# EAGLE design erprog_1504-1 (EAGLE 6.6.0)
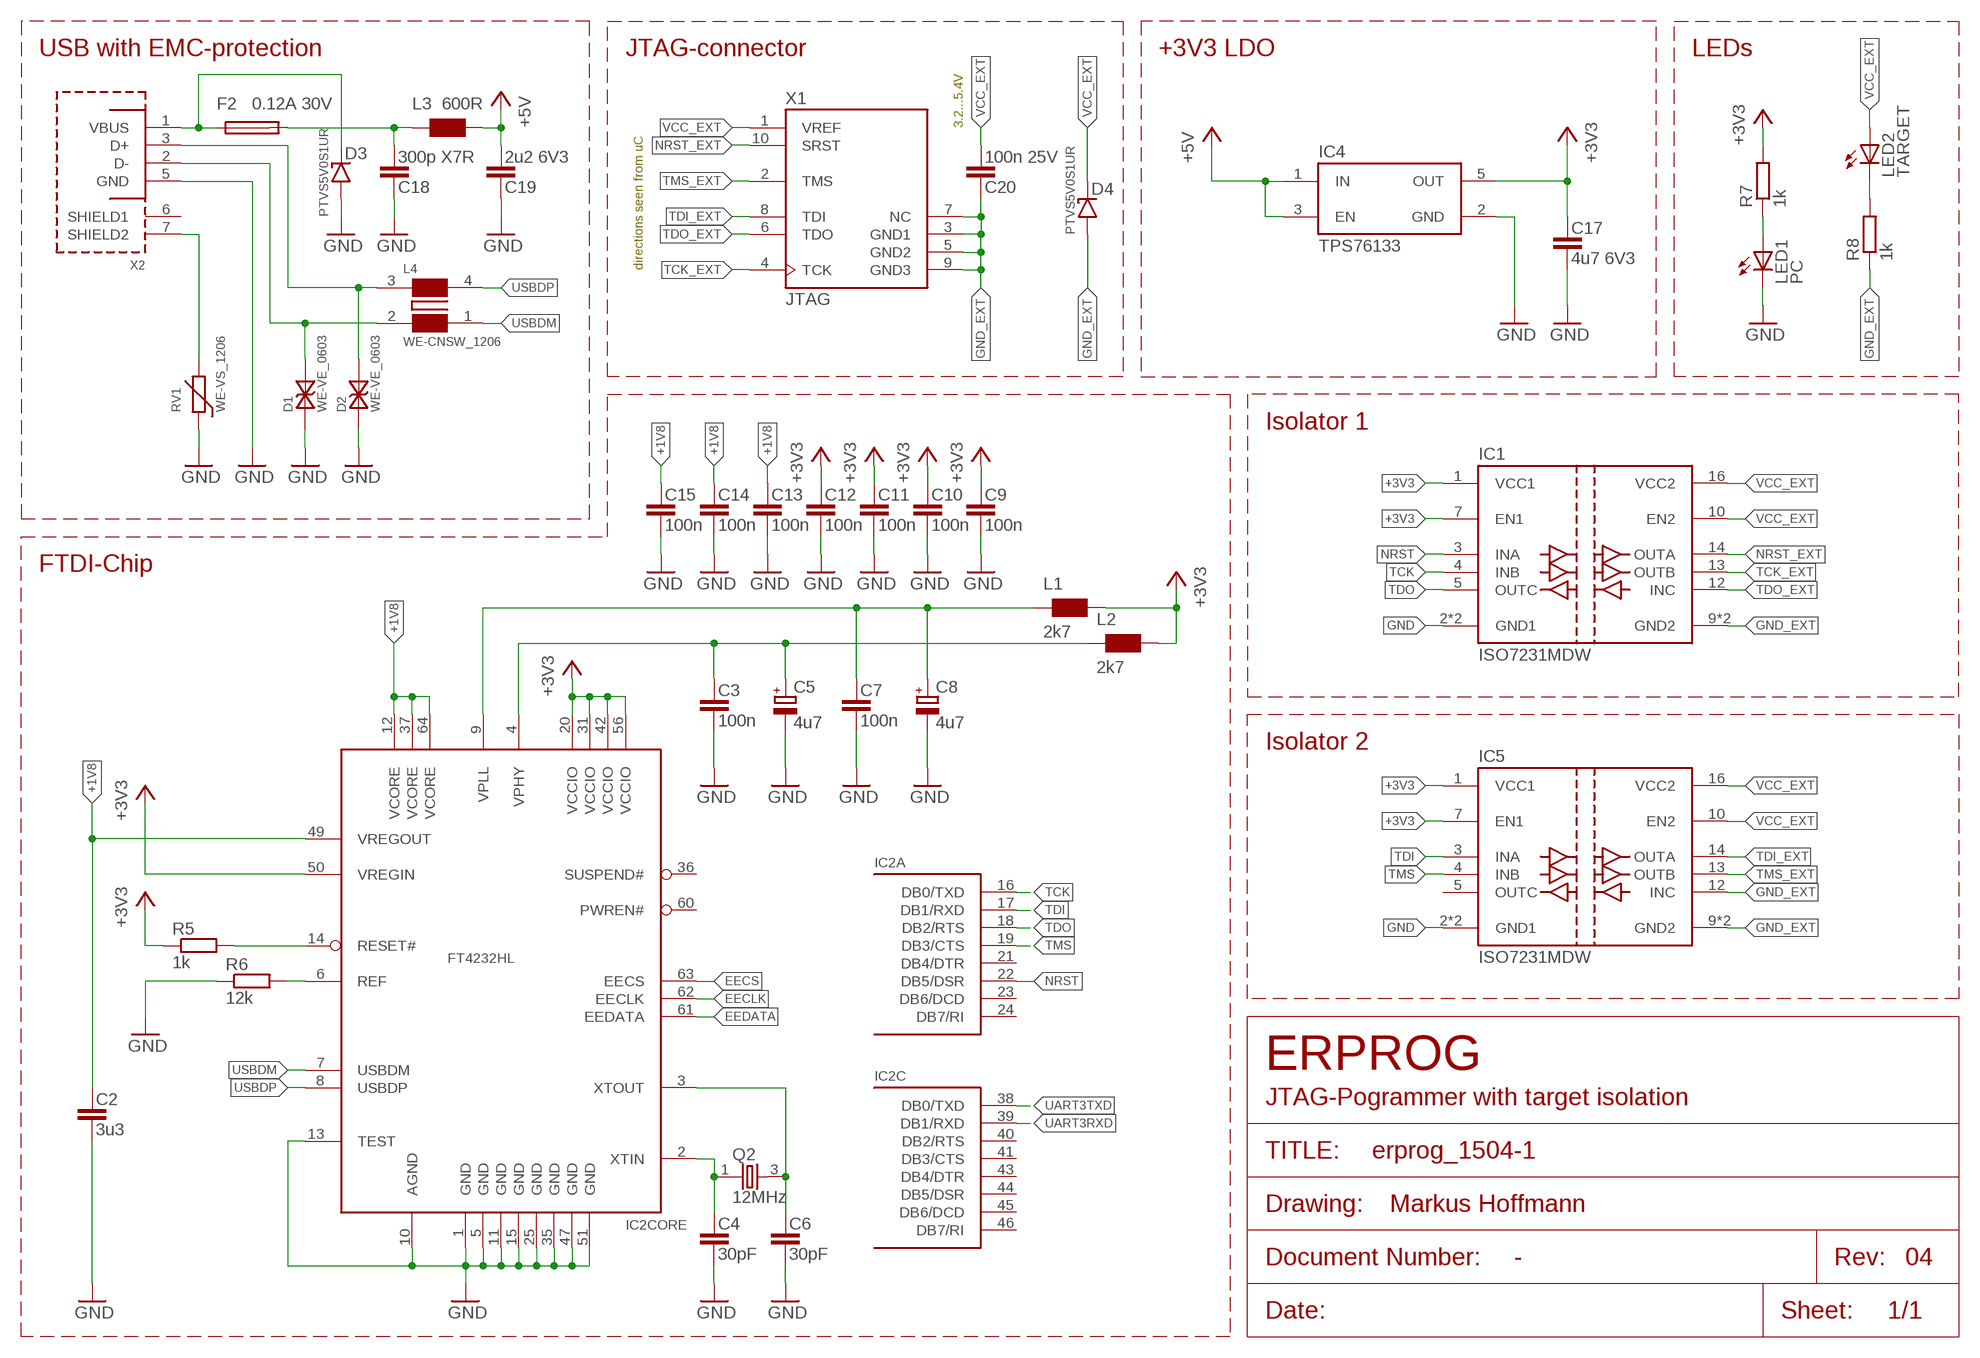
[diagram p0: schematic, sheet 1]
FRAME1 (DINA4_L): AUTHOR: Markus Hoffmann; DOC_NUMBER: -; REVISION: 04; SUBTITLE: JTAG-Pogrammer with target isolation; TITLE: ERPROG

## Parts
C2  3u3  C-EUC0603  [C0603]
C3  100n  C-EUC0603  [C0603]
C4  30pF  C-EUC0603  [C0603]
C5  4u7  CPOL-EUA/3216-18R  [A/3216-18R]
C6  30pF  C-EUC0603  [C0603]
C7  100n  C-EUC0603  [C0603]
C8  4u7  CPOL-EUA/3216-18R  [A/3216-18R]
C9  100n  C-EUC0603  [C0603]
C10  100n  C-EUC0603  [C0603]
C11  100n  C-EUC0603  [C0603]
C12  100n  C-EUC0603  [C0603]
C13  100n  C-EUC0603  [C0603]
C14  100n  C-EUC0603  [C0603]
C15  100n  C-EUC0603  [C0603]
C17  4u7 6V3  C-EUC0805  [C0805]
C18  300p X7R  C-EUC0603  [C0603]
C19  2u2 6V3  C-EUC0603  [C0603]
C20  100n 25V  C-EUC0603  [C0603]
D1  WE-VE_0603  [WESURGE_0603]
D2  WE-VE_0603  [WESURGE_0603]
D3  PTVS5V0S1UR  [SOD123]
D4  PTVS5V0S1UR  [SOD123]
F2  0.12A 30V  MF-NSMF012-2  [MF-NSMF-1]
IC1  ISO7231MDW  [SO16_SOT162-1]
IC2  FT4232HL  [LQFP64]
IC4  TPS76133  TPS76133SOT23  [SOT-23-5]
IC5  ISO7231MDW  [SO16_SOT162-1]
L1  2k7  WE-CBF_0805  [0805]
L2  2k7  WE-CBF_0805  [0805]
L3  600R  WE-CBF_0805  [0805]
L4  WE-CNSW_1206  [WE-CNSW_1206]
LED1  PC  LEDSML0805  [SML0805]
LED2  TARGET  LEDSML0805  [SML0805]
Q2  12MHz  MQ  [MQ]
R5  1k  R-EU_R0603  [R0603]
R6  12k  R-EU_R0603  [R0603]
R7  1k  R-EU_R0603  [R0603]
R8  1k  R-EU_R0603  [R0603]
RV1  WE-VS_1206  [WESURGE_1206]
X1  JTAG  CORESIGHT-JTAG-10THD10R  [ML10R]
X2  USB-SHIELD-MINI-B-BUCHSE-R-ASSMANN  [USB-MINI-B-BUCHSE-R]

## Nets
+1V8: C2.1 C13.1 C14.1 C15.1 IC2.12(CORE:VCORE) IC2.37(CORE:VCORE) IC2.49(CORE:VREGOUT) IC2.64(CORE:VCORE)
+3V3: C9.1 C10.1 C11.1 C12.1 C17.1 IC1.1(VCC1) IC1.7(EN1) IC2.20(CORE:VCCIO) IC2.31(CORE:VCCIO) IC2.42(CORE:VCCIO) IC2.50(CORE:VREGIN) IC2.56(CORE:VCCIO) IC4.5(OUT) IC5.1(VCC1) IC5.7(EN1) L1.2 L2.2 R5.1 R7.2
+5V: C19.2 IC4.1(IN) IC4.3(EN) L3.2
EECLK: IC2.62(CORE:EECLK)
EECS: IC2.63(CORE:EECS)
EEDATA: IC2.61(CORE:EEDATA)
GND: C2.2 C3.2 C4.2 C5.- C6.2 C7.2 C8.- C9.2 C10.2 C11.2 C12.2 C13.2 C14.2 C15.2 C17.2 C18.1 C19.1 D1.2 D2.2 D3.A(ANODE) IC1.2(GND1) IC1.8(GND1) IC2.1(CORE:GND) IC2.5(CORE:GND) IC2.10(CORE:AGND) IC2.11(CORE:GND) IC2.13(CORE:TEST) IC2.15(CORE:GND) IC2.25(CORE:GND) IC2.35(CORE:GND) IC2.47(CORE:GND) IC2.51(CORE:GND) IC4.2(GND) IC5.2(GND1) IC5.8(GND1) LED1.C R6.1 RV1.1 X2.5(GND)
GND_EXT: C20.1 D4.A(ANODE) IC1.9(GND2) IC1.15(GND2) IC5.9(GND2) IC5.12(INC) IC5.15(GND2) R8.1 X1.3(GND1) X1.5(GND2) X1.7(NC) X1.9(GND3)
N$1: D3.C(KATHODE) F2.1 X2.1(VBUS)
N$2: LED1.A R7.1
N$3: D1.1 L4.2 X2.2(D-)
N$4: RV1.2 X2.7(SHIELD2)
N$5: LED2.C R8.2
N$6: C18.2 F2.2 L3.1
N$7: D2.1 L4.3 X2.3(D+)
N$39: IC2.14(CORE:RESET#) R5.2
N$40: IC2.6(CORE:REF) R6.2
N$44: C3.1 C5.+ IC2.4(CORE:VPHY) L2.1
N$45: C7.1 C8.+ IC2.9(CORE:VPLL) L1.1
N$46: C6.1 IC2.3(CORE:XTOUT) Q2.3
N$47: C4.1 IC2.2(CORE:XTIN) Q2.1
NRST: IC1.3(INA) IC2.22(A:DB5/DSR)
NRST_EXT: IC1.14(OUTA) X1.10(SRST)
TCK: IC1.4(INB) IC2.16(A:DB0/TXD)
TCK_EXT: IC1.13(OUTB) X1.4(TCK)
TDI: IC2.17(A:DB1/RXD) IC5.3(INA)
TDI_EXT: IC5.14(OUTA) X1.8(TDI)
TDO: IC1.5(OUTC) IC2.18(A:DB2/RTS)
TDO_EXT: IC1.12(INC) X1.6(TDO)
TMS: IC2.19(A:DB3/CTS) IC5.4(INB)
TMS_EXT: IC5.13(OUTB) X1.2(TMS)
UART3RXD: IC2.39(C:DB1/RXD)
UART3TXD: IC2.38(C:DB0/TXD)
USBDM: IC2.7(CORE:USBDM) L4.1
USBDP: IC2.8(CORE:USBDP) L4.4
VCC_EXT: C20.2 D4.C(KATHODE) IC1.10(EN2) IC1.16(VCC2) IC5.10(EN2) IC5.16(VCC2) LED2.A X1.1(VREF)
Unconnected: IC2.21(A:DB4/DTR) IC2.23(A:DB6/DCD) IC2.24(A:DB7/RI) IC2.26(B:DB0/TXD) IC2.27(B:DB1/RXD) IC2.28(B:DB2/RTS) IC2.29(B:DB3/CTS) IC2.30(B:DB4/DTR) IC2.32(B:DB5/DSR) IC2.33(B:DB6/DCD) IC2.34(B:DB7/RI) IC2.36(CORE:SUSPEND#) IC2.40(C:DB2/RTS) IC2.41(C:DB3/CTS) IC2.43(C:DB4/DTR) IC2.44(C:DB5/DSR) IC2.45(C:DB6/DCD) IC2.46(C:DB7/RI) IC2.48(D:DB0/TXD) IC2.52(D:DB1/RXD) IC2.53(D:DB2/RTS) IC2.54(D:DB3/CTS) IC2.55(D:DB4/DTR) IC2.57(D:DB5/DSR) IC2.58(D:DB6/DCD) IC2.59(D:DB7/RI) IC2.60(CORE:PWREN#) IC5.5(OUTC) X2.6(SHIELD1)

## Notes on the sheet
- USB with EMC-protection | JTAG-connector | +3V3 LDO | LEDs
- 3.2...5.4V
- directions seen from uC
- Isolator 1
- FTDI-Chip
- Isolator 2

## Library data of the parts
C2-C4 C6 C7 C9-C15 C17-C20 = rcl:C-EU: CAPACITOR, European symbol
C5 C8 = rcl:CPOL-EU: POLARIZED CAPACITOR, European symbol
D1 D2 = wuerth_elektronik_v68:WE-VE: WESURGE ESD Suppressor WE-VE - Fast response time - No leakage current - Low clamping voltage - Almost no energy consumption in stand-by mode - Excellent absorption for ESD-impulses - Designed to meet the EN 61000-4-2 standard - Nickel barrier - Operating temperature: -40°C to +85°C -- Protection of data lines -- Protection of bus system -- Protection of semiconductors -- ESD protection in accordance with EN 61000-4-2; 8 kV contact discharge / 15 kV air discharge; WE: 82356240030; WUERTH_ELETRONIK: 82356240030
D3 D4 = diode:PTVS*S1UR: 400 W unidirectional Transient Voltage Suppressor (TVS) in a SOD123W small and flat lead low-profile Surface-Mounted Device (SMD) plastic package, designed for transient overvoltage protection.; FARNELL: 1829262; MOUSER: 771-PTVS5V0S1UR115; NXP: PTVS5V0S1UR; PRICE100: 0.243; V_BR: 6.70V
F2 = fuse:MF-NSMF; BOURNS: MF-NSMF012-2; FARNELL: 2309137; I_HOLD: 0.120A; PRICE5: 0.477; U_MAX: 30V
IC1 IC5 = ti:ISO7231*?
IC2 = ftdichip-5:FT4232H: Quad USB UART 5th generation USB to 4-port serial controller; FARNELL: 1697463; PRICE: 11,29€
IC4 = vreg:TPS76*: The TPS761xx is a 100 mA, low dropout (LDO) voltage regulator designed specifically for battery-powered applications. A proprietary BiCMOS fabrication process allows the TPS761xx to provide outstanding performance in all specifications critical to battery-powered operation. The TPS761xx is available in a space-saving SOT-23 (DBV) package and operates over a junction temperature range of –40 ° C to 125 ° C.; FARNELL: 8461295; PRICE: 1,17€; TI: TPS76133
L1 L2 = wuerth_elektronik_v68:WE-CBF: SMD EMI Suppression Ferrite Beads WE-CBF - Excellent anti-EMI properties - Low DC-restistance - Impedances till 3000 ohms - Rated current up to 6 A -- Reliable Ni-Sn electrodes -- Perfect as data lined filter and for uncoupling of distribution voltage; FARNELL: 1800366; WE: 742792095
L3 = wuerth_elektronik_v68:WE-CBF: SMD EMI Suppression Ferrite Beads WE-CBF - Excellent anti-EMI properties - Low DC-restistance - Impedances till 3000 ohms - Rated current up to 6 A -- Reliable Ni-Sn electrodes -- Perfect as data lined filter and for uncoupling of distribution voltage; WE: 742792040
L4 = wuerth_elektronik_v68:WE-CNSW: SMD Common Mode Noise Suppressor WE-CNSW - High common mode suppression at high frequency - Small influence for high speed signals through winding symmetry -- USB 2.0 -- Firewire / IEEE 1394 -- Power supply systems -- High Speed Data Lines -- Common mode data line filter; FARNELL: 1636474; PRICE1: 1.01; WE: 744232090; WUERTH_ELETRONIK: 744232090
LED1 LED2 = led:LED: LED OSRAM: - CHIPLED LG R971, LG N971, LY N971, LG Q971, LY Q971, LO R971, LY R971 LH N974, LH R974 LS Q976, LO Q976, LY Q976 LO Q996 - Hyper CHIPLED LW Q18S LB Q993, LB Q99A, LB R99A - SideLED LS A670, LO A670, LY A670, LG A670, LP A670 LB A673, LV A673, LT A673, LW A673 LH A674 LY A675 LS A676, LA A676, LO A676, LY A676, LW A676 LS A679, LY A679, LG A679 - Hyper Micro SIDELED® LS Y876, LA Y876, LO Y876, LY Y876 LT Y87S - SmartLED LW L88C, LW L88S LB L89C, LB L89S, LG L890 LS L89K, LO L89K, LY L89K LS L896, LA L896, LO L896, LY L896 - TOPLED LS T670, LO T670, LY T670, LG T670, LP T670 LSG T670, LSP T670, LSY T670, LOP T670, LYG T670 LG T671, LOG T671, LSG T671 LB T673, LV T673, LT T673, LW T673 LH T674 LS T676, LA T676, LO T676, LY T676, LB T676, LH T676, LSB T676, LW T676 LB T67C, LV T67C, LT T67C, LS T67K, LO T67K, LY T67K, LW E67C LS E67B, LA E67B, LO E67B, LY E67B, LB E67C, LV E67C, LT E67C LW T67C LS T679, LY T679, LG T679 LS T770, LO T770, LY T770, LG T770, LP T770 LB T773, LV T773, LT T773, LW T773 LH T774 LS E675, LA E675, LY E675, LS T675 LS T776, LA T776, LO T776, LY T776, LB T776 LHGB T686 LT T68C, LB T68C - Hyper Mini TOPLED® LB M676 - Mini TOPLED Santana® LG M470 LS M47K, LO M47K, LY M47K Source: http://www.osram.convergy.de LUXEON: - LUMILED® LXK2-PW12-R00, LXK2-PW12-S00, LXK2-PW14-U00, LXK2-PW14-V00 LXK2-PM12-R00, LXK2-PM12-S00, LXK2-PM14-U00 LXK2-PE12-Q00, LXK2-PE12-R00, LXK2-PE12-S00, LXK2-PE14-T00, LXK2-PE14-U00 LXK2-PB12-K00, LXK2-PB12-L00, LXK2-PB12-M00, LXK2-PB14-N00, LXK2-PB14-P00, LXK2-PB14-Q00 LXK2-PR12-L00, LXK2-PR12-M00, LXK2-PR14-Q00, LXK2-PR14-R00 LXK2-PD12-Q00, LXK2-PD12-R00, LXK2-PD12-S00 LXK2-PH12-R00, LXK2-PH12-S00 LXK2-PL12-P00, LXK2-PL12-Q00, LXK2-PL12-R00 Source: www.luxeon.com KINGBRIGHT: KA-3528ASYC Source: www.kingbright.com
Q2 = crystal-1:MQ
R5-R8 = rcl:R-EU_: RESISTOR, European symbol
RV1 = wuerth_elektronik_v68:WE-VS: WESURGE SMD Varistor WE-VS - Fast response time - Low leakage current - Low clamping voltage - Wide range of voltage avaible - Almost no energy consumption in stand-by mode - Excellent absorption at surge-impulses - Nickel barrier for leadfree soldering - Operating temperature: -40°C to +85°C for size 0402 to 0805; -40°C to +1255°C for size 1206 to 2220 -- Protection of DC distribution -- Protection of power supply -- Protection of semiconductors -- Protection of bus systems and communication lines -- Limiting of over-voltage -- ESD protection in accordance with EN 61000-4-2 and Surge protection in accordance with EN 61000-4-5; FARNELL: 1636449; PRICE1: 0.74; WE: 82541140; WUERTH_ELEKTRONIK: 82541140
X1 = con-programming:CORESIGHT-JTAG-10: CoreSight 10 The CoreSight 10 connector can be used in either standard JTAG (IEEE 1149.1) mode or Serial Wire Debug (SWD) mode.; PRICE1: 0.109; REICHELT: WSL 10W
X2 = con-usb-3:USB-SHIELD; ASSMANN: A-USBB-M5; PRICE: 1,10€; REICHELT: USB BWM

## Board
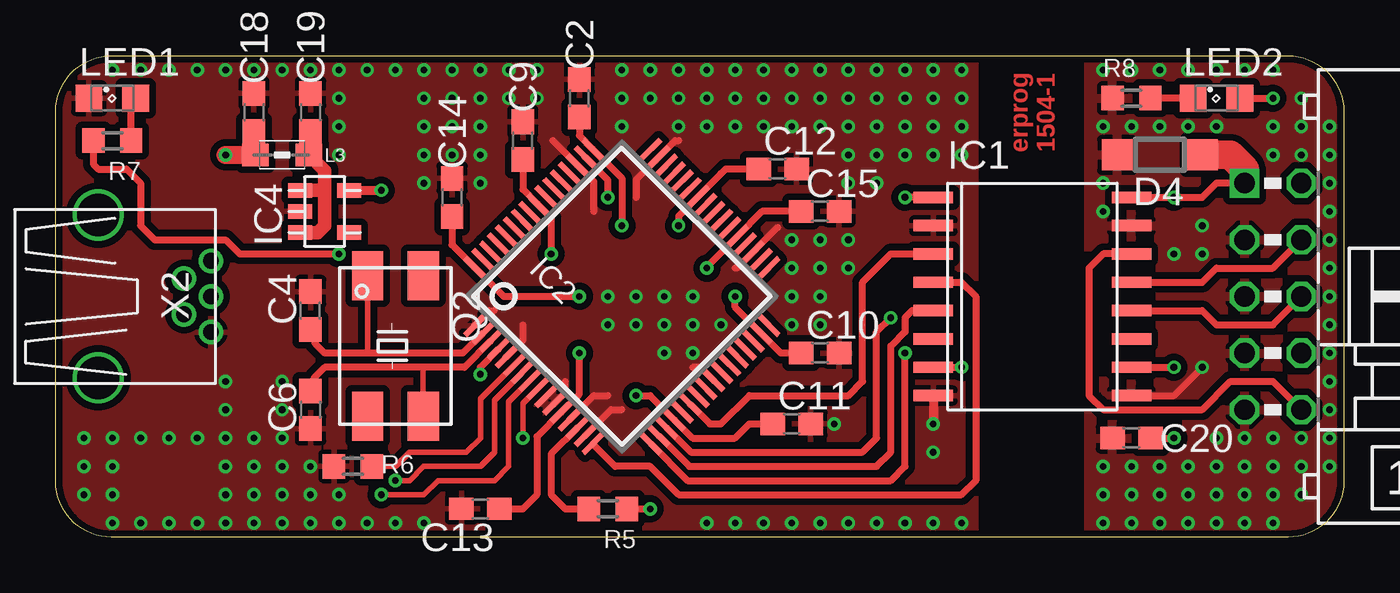
[diagram p1: board, top side]
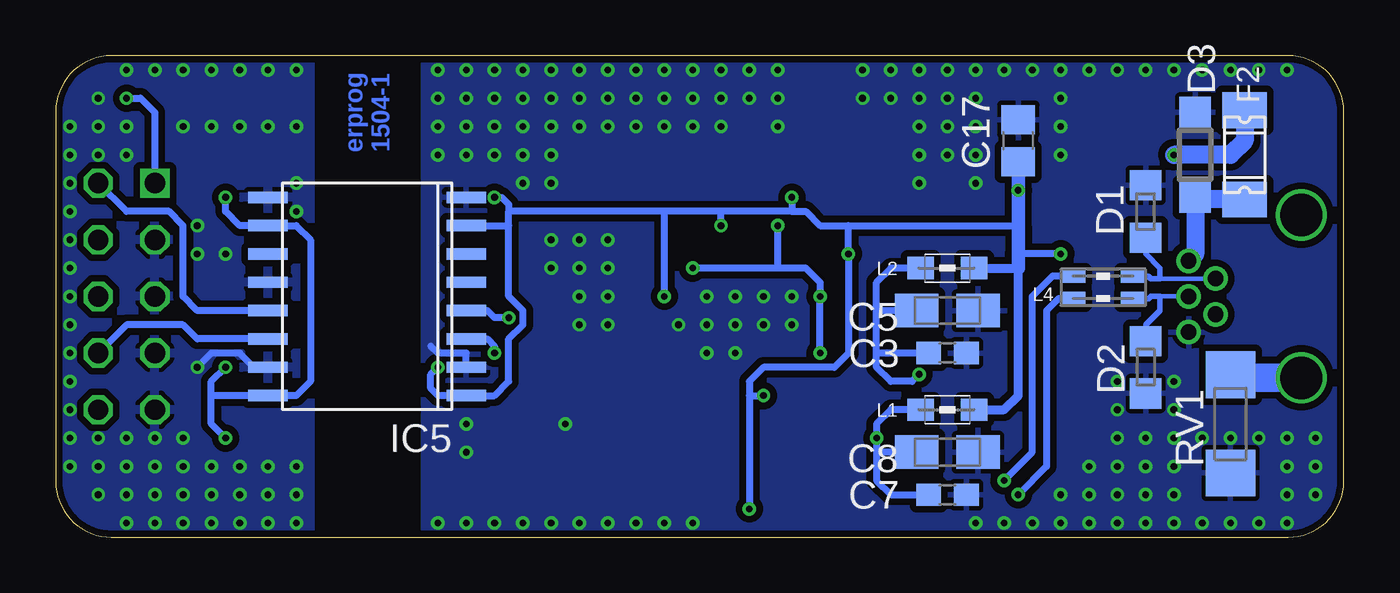
[diagram p2: board, bottom side, seen from below]

Size 57.78 x 21.59 mm. Coordinates in mm from the lower left corner, seen from the top.
Outline: 0,19.09 arc-90 2.5,21.59 55.28,21.59 arc-90 57.78,19.09 57.78,2.5 arc-90 55.28,0 2.5,0 arc-90 0,2.5 0,19.09
Copper layers (1*16): Top 0.035mm / dielectric 1.5mm / Bottom 0.035mm
Design rules "PCB-POOL_Standard": minimum track width 0.15mm, minimum drill 0.3mm, track to track 0.15mm, track to pad 0.15mm, pad to pad 0.15mm, via to via 0.15mm, smd to smd 0.15mm, copper to edge 0.3mm, drill to drill 0.2mm, minimum pad ring 0.2mm, minimum via ring 0.15mm, stop-mask expansion 0.075mm, vias tented up to drill 0mil, thermal gap 0.2mm

### Footprints (pad centres in the part's own frame; a part is rotated, then mirrored left to right if it is on the bottom)
C0603 = smd 1.1 x 1: 1 -0.85,0; 2 0.85,0
A/3216-18R = smd 1.95 x 1.5: + 1.375,0; - -1.375,0
C0805 = smd 1.3 x 1.5: 1 -0.95,0; 2 0.95,0
WESURGE_0603 = smd 1.35 x 1.4: 1 -1.175,0; 2 1.175,0
SOD123 = smd 1.4 x 1.4: A 1.9,0; C -1.9,0
MF-NSMF-1 = smd 1.6 x 2: 1 -2,0; 2 2,0
SO16_SOT162-1 = smd 1.778 x 0.508: 1 -4.445,4.445; 2 -4.445,3.175; 3 -4.445,1.905; 4 -4.445,0.635; 5 -4.445,-0.635; 6 -4.445,-1.905; 7 -4.445,-3.175; 8 -4.445,-4.445; 9 4.445,-4.445; 10 4.445,-3.175; 11 4.445,-1.905; 12 4.445,-0.635; 13 4.445,0.635; 14 4.445,1.905; 15 4.445,3.175; 16 4.445,4.445
LQFP64 = smd 0.25 x 1.2: 1 -3.75,-5.6; 2 -3.25,-5.6; 3 -2.75,-5.6; 4 -2.25,-5.6; 5 -1.75,-5.6; 6 -1.25,-5.6; 7 -0.75,-5.6; 8 -0.25,-5.6; 9 0.25,-5.6; 10 0.75,-5.6; 11 1.25,-5.6; 12 1.75,-5.6; 13 2.25,-5.6; 14 2.75,-5.6; 15 3.25,-5.6; 16 3.75,-5.6; 33 3.75,5.6; 34 3.25,5.6; 35 2.75,5.6; 36 2.25,5.6; 37 1.75,5.6; 38 1.25,5.6; 39 0.75,5.6; 40 0.25,5.6; 41 -0.25,5.6; 42 -0.75,5.6; 43 -1.25,5.6; 44 -1.75,5.6; 45 -2.25,5.6; 46 -2.75,5.6; 47 -3.25,5.6; 48 -3.75,5.6 | smd 1.2 x 0.25: 17 5.6,-3.75; 18 5.6,-3.25; 19 5.6,-2.75; 20 5.6,-2.25; 21 5.6,-1.75; 22 5.6,-1.25; 23 5.6,-0.75; 24 5.6,-0.25; 25 5.6,0.25; 26 5.6,0.75; 27 5.6,1.25; 28 5.6,1.75; 29 5.6,2.25; 30 5.6,2.75; 31 5.6,3.25; 32 5.6,3.75; 49 -5.6,3.75; 50 -5.6,3.25; 51 -5.6,2.75; 52 -5.6,2.25; 53 -5.6,1.75; 54 -5.6,1.25; 55 -5.6,0.75; 56 -5.6,0.25; 57 -5.6,-0.25; 58 -5.6,-0.75; 59 -5.6,-1.25; 60 -5.6,-1.75; 61 -5.6,-2.25; 62 -5.6,-2.75; 63 -5.6,-3.25; 64 -5.6,-3.75
SOT-23-5 = smd 0.65 x 1.06: 1 -0.95,-1.1; 2 0,-1.1; 3 0.95,-1.1; 4 0.95,1.1; 5 -0.95,1.1
0805 = smd 1.2 x 1: 1 -1.2,0; 2 1.2,0
WE-CNSW_1206 = smd 0.6 x 1.1: 1 -0.5,-1.35; 2 -0.5,1.35; 3 0.5,1.35; 4 0.5,-1.35
SML0805 = smd 1.2 x 1.2: A 1.05,0; C -1.05,0
MQ = smd 2.2 x 1.4: 1 -3.15,-1.25; 2 3.15,-1.25; 3 3.15,1.25; 4 -3.15,1.25
R0603 = smd 1 x 1.1: 1 -0.85,0; 2 0.85,0
WESURGE_1206 = smd 2.1 x 2.2: 1 -2.2,0; 2 2.2,0
ML10R = drill 0.914 square: 1 -5.08,-1.27 | drill 0.914 octagon: 2 -5.08,1.27; 3 -2.54,-1.27; 4 -2.54,1.27; 5 0,-1.27; 6 0,1.27; 7 2.54,-1.27; 8 2.54,1.27; 9 5.08,-1.27; 10 5.08,1.27
USB-MINI-B-BUCHSE-R = drill 0.7: 1 5.05,1.6; 2 3.85,0.8; 3 5.05,0; 4 3.85,-0.8; 5 5.05,-1.6 | drill 1.9: 6 0,3.65; 7 0,-3.65

### Placement (x,y rotation side)
C2  23.5,19.69 90 top
C3  17.78,8.25 0 bottom
C4  11.43,10.16 90 top
C5  17.78,10.16 180 bottom
C6  11.43,5.71 270 top
C7  17.78,1.9 0 bottom
C8  17.78,3.81 180 bottom
C9  20.95,17.78 90 top
C10  34.29,8.25 0 top
C11  33.02,5.08 0 top
C12  32.38,16.51 0 top
C13  19.05,1.27 180 top
C14  17.78,15.24 90 top
C15  34.29,14.61 0 top
C17  14.61,17.78 90 bottom
C18  8.89,19.05 270 top
C19  11.43,19.05 270 top
C20  48.26,4.45 0 top
D1  8.89,14.61 90 bottom
D2  8.89,7.62 270 bottom
D3  6.67,17.14 90 bottom
D4  49.53,17.14 180 top
F2  4.45,17.14 90 bottom
IC1  43.81,10.79 0 top
IC2  25.4,10.79 315 top
IC4  12.06,14.61 270 top
IC5  43.81,10.79 180 bottom
L1  17.78,5.71 0 bottom
L2  17.78,12.06 0 bottom
L3  10.16,17.14 0 top
L4  10.79,11.2 270 bottom
LED1  2.54,19.69 0 top
LED2  52.07,19.69 0 top
Q2  15.24,8.57 270 top
R5  24.77,1.27 180 top
R6  13.34,3.17 0 top
R7  2.54,17.78 180 top
R8  48.26,19.69 0 top
RV1  5.08,5.08 90 bottom
X1  54.61,10.79 270 top
X2  1.91,10.79 0 top

### Tracks (layer width: path | path; a pad name or v marks a point on that pad's centre or on a via)
+1V8  (via drill 0.3)
  Top 0.305: v25.4,13.97 25.4,16.1 IC2.49 23.5,18 C2.1 | v23.5,10.79 20.1,10.79 IC2.64 17.78,13.11 C14.1 | v23.5,8.25 23.5,6.42 IC2.12 21.59,4.51 21.59,1.9 20.95,1.27 C13.1 | v29.21,12.06 29.14,12.06 IC2.37 31.68,14.61 C15.1
  Bottom 0.305: v23.5,8.25 v23.5,10.79 23.5,11.43 24.13,12.06 25.4,12.06 | 25.4,12.06 v29.21,12.06 | v25.4,13.97 25.4,12.06
+3V3  (via drill 0.3)
  Top 0.305: IC2.50 24.77,16.03 v24.77,15.24 | v30.48,10.79 30.48,10.31 IC2.31 32.54,8.25 C10.1 | v27.94,13.97 27.94,14.4 IC2.42 29.84,16.3 30.05,16.51 C12.1 | C11.1 31.11,5.08 30.47,4.44 28.57,4.44 IC2.20 26.67,6.34 v26.04,6.34 v26.04,6.35 | v22.23,12.7 22.23,14.32 IC2.56 20.95,15.59 C9.1 | R5.1 v26.67,1.27 | IC1.7 v40.64,7.62 | R7.2 1.69,16.73 1.91,16.51 3.17,16.51 3.81,15.88 3.81,13.97 4.45,13.34 7.62,13.34 8.26,12.7 v12.7,12.7 | IC1.1 v38.1,15.24
  Top 0.406: IC4.5 v14.61,15.55 v14.61,15.56
  Bottom 0.305: 26.67,6.35 26.67,6.98 26.04,7.62 22.86,7.62 22.23,8.25 v22.23,12.7 22.23,13.97 | 26.67,6.35 v26.67,1.27 | 22.23,13.97 14.61,13.97 | 37.47,13.97 37.47,10.79 36.83,10.16 36.83,9.53 37.47,8.89 37.47,6.98 38.1,6.35 IC5.1 40.64,6.35 40.96,6.67 40.96,7.3 v40.64,7.62 | 37.47,13.97 37.47,14.61 | IC5.7 37.47,13.97 | 26.67,6.35 v26.04,6.35 | 24.77,14.61 27.94,14.61 | 27.94,14.61 30.48,14.61 | 30.48,14.61 37.47,14.61 | v24.77,15.24 24.77,14.61 | v27.94,13.97 27.94,14.61 | v30.48,10.79 30.48,14.61 | 24.77,14.61 24.13,14.61 23.5,13.97 22.23,13.97 | v12.7,12.7 14.61,12.7 | v38.1,15.24 37.78,15.24 37.47,14.92 37.47,14.61
  Bottom 0.406: L1.2 15.24,5.71 14.61,6.35 14.61,12.06 L2.2
  Bottom 0.61: 14.61,12.06 14.61,12.7 14.61,13.97 v14.61,15.56 C17.1
+5V
  Top 0.61: IC4.3 11.75,13.65 12.06,13.97 12.06,15.55 | IC4.1 12.06,15.55 | 12.06,15.55 12.06,16.44 L3.2 11.43,17.21 C19.2
GND  (via drill 0.3)
  Top 0.305: 28.57,7.62 28.93,7.62 IC2.25 | 30.56,12.06 30.48,12.06 | IC2.1 19.46,10.16 19.68,10.16 | 22.3,17.78 IC2.51 24.13,15.95 24.13,14.61 | 27.94,17.78 27.79,17.78 26.91,16.9 | IC2.47 26.91,16.9 | 26.91,16.9 | 30.56,12.06 32.38,13.89 | IC2.35 30.56,12.06 | 30.56,12.06 | 26.91,16.9 26.04,16.03 26.04,15.24 | IC2.5 20.95,8.82 20.95,9.53 | IC2.13 24.14,6.35 24.77,6.35 | IC2.15 24.92,5.71 25.4,5.71 | IC2.11 22.86,6.49 22.86,6.98
  Top 0.406: IC1.8 v39.37,5.08
  Bottom 0.305: IC5.2 39.37,8.25 40.64,8.25 40.96,8.57
  other vias: 29.21,0.63 30.48,0.63 31.75,0.63 33.02,0.63 34.29,0.63 35.56,0.63 36.83,0.63 38.1,0.63 39.37,0.63 25.4,20.95 26.67,20.95 27.94,20.95 29.21,20.95 30.48,20.95 31.75,20.95 33.02,20.95 34.29,20.95 35.56,20.95 36.83,20.95 38.1,20.95 39.37,20.95 40.64,20.95 39.37,19.69 40.64,19.69 39.37,18.41 38.1,18.41 38.1,19.69 36.83,19.69 36.83,18.41 36.83,17.14 38.1,17.14 39.37,17.14 40.64,17.14 35.56,19.69 35.56,18.41 35.56,17.14 34.29,18.41 34.29,19.69 33.02,19.69 33.02,18.41 31.75,18.41 31.75,19.69 30.48,19.69 30.48,18.41 29.21,19.69 27.94,19.69 26.67,19.69 25.4,19.69 11.43,0.63 7.62,0.63 40.64,0.63 8.89,0.63 10.16,0.63 10.16,1.9 8.89,1.9 40.64,18.41 2.54,0.63 2.54,3.17 15.24,0.63 13.97,0.63 1.27,3.17 2.54,1.9 1.27,1.9 3.81,0.63 5.08,0.63 6.35,0.63 12.7,0.63 7.62,1.9 12.7,1.9 11.43,1.9 35.56,13.34 34.29,12.06 35.56,12.06 34.29,13.34 34.29,10.79 34.29,9.53 34.92,5.08 10.16,3.17 11.43,3.17 16.51,0.63 21.59,20.95 21.59,19.69 20.32,19.69 20.32,20.95 19.05,20.95 19.05,19.69 19.05,18.41 19.05,17.14 2.54,20.95 3.81,20.95 5.08,20.95 6.35,20.95 7.62,20.95 8.89,20.95 10.16,20.95 11.43,20.95 12.7,20.95 8.89,3.17 7.62,3.17 2.54,4.45 1.27,4.45 7.62,4.45 8.89,4.45 10.16,4.45 6.35,4.45 5.08,4.45 3.81,4.45 10.16,5.71 10.16,6.98 7.62,5.71 7.62,6.98 12.7,19.69 12.7,18.41 12.7,17.14 13.97,20.95 15.24,20.95 16.51,20.95 16.51,19.69 16.51,18.41 16.51,17.14 17.78,18.41 17.78,19.69 17.78,20.95 17.78,17.14 29.21,18.41 27.94,18.41 25.4,18.41 19.05,15.88 16.51,15.88 39.37,3.81 33.02,10.79 33.02,12.06 33.02,13.34 33.02,9.53 35.56,15.88 36.83,15.88 24.77,10.79 24.77,9.53 26.04,9.53 26.04,10.79 27.3,10.79 27.3,9.53 27.3,8.25 28.57,10.79 28.57,9.53 28.57,8.25 29.84,9.53
  pour Bottom (isolate 0.305): -0.64,22.23 41.27,22.23 41.27,-0.63 -0.64,-0.63
  pour Top (isolate 0.305): -0.64,22.23 41.27,22.23 41.27,-0.63 -0.64,-0.63
GND_EXT  (via drill 0.3)
  Top 0.305: IC1.9 50.16,6.35 v51.44,7.62
  Bottom 0.305: IC5.15 48.9,7.62 49.53,8.25 50.8,8.25 v51.44,7.62
  other vias: 57.15,3.17 48.26,1.9 49.53,0.63 48.26,0.63 49.53,1.9 46.99,15.88 57.15,18.41 55.88,18.41 54.61,18.41 50.8,1.9 52.07,1.9 53.34,1.9 54.61,1.9 55.88,1.9 54.61,0.63 53.34,0.63 52.07,0.63 50.8,0.63 55.88,3.17 54.61,3.17 53.34,3.17 52.07,3.17 50.8,3.17 49.53,3.17 48.26,3.17 46.99,18.41 55.88,19.69 54.61,20.95 46.99,1.9 46.99,3.17 52.07,4.45 53.34,4.45 54.61,4.45 55.88,4.45 57.15,4.45 57.15,17.14 55.88,17.14 54.61,17.14 46.99,14.61 57.15,5.71 57.15,6.98 57.15,8.25 57.15,9.53 57.15,10.79 57.15,12.06 57.15,13.34 57.15,14.61 57.15,15.88 53.34,20.95 52.07,20.95 50.8,20.95 49.53,20.95 48.26,20.95 46.99,20.95 48.26,18.41 49.53,18.41 50.8,18.41 52.07,18.41 51.44,13.97 51.44,12.7 50.16,12.7 46.99,0.63
  pour Bottom (isolate 0.305): 46.35,22.23 58.42,22.23 58.42,-0.63 46.35,-0.63
  pour Top (isolate 0.305): 46.35,22.23 58.42,22.23 58.42,-0.63 46.35,-0.63
N$1
  Bottom 0.813: X2.1 6.67,12.68 D3.C 6.57,15.14 F2.1
N$2
  Top 0.305: R7.1 3.39,19.48 LED1.A
N$3
  Bottom 0.203: X2.2 8.26,11.6
  Bottom 0.254: D1.1 8.89,12.7 8.26,12.06 8.26,11.6 8.66,11.6 8.77,11.7 L4.2
N$4
  Bottom 1.27: X2.7 4.31,7.14 RV1.2
N$5
  Top 0.305: LED2.C R8.2
N$6  (via drill 0.3)
  Top 0.61: L3.1 8.89,17.14 C18.2
  Top 0.813: v7.62,17.14 8.89,17.14
  Bottom 0.813: F2.2 4.45,17.78 5.08,17.14 v7.62,17.14
N$7
  Bottom 0.203: X2.3 8.26,10.79
  Bottom 0.254: D2.1 8.89,9.53 8.26,10.16 8.26,10.79 8.65,10.79 8.74,10.7 L4.3
N$39
  Top 0.305: R5.2 22.86,1.27 22.23,1.9 22.23,3.73 IC2.14
N$40
  Top 0.254: IC2.6 19.05,6.21 19.05,4.45 18.41,3.81 15.88,3.81 15.24,3.17 R6.2
N$44  (via drill 0.3)
  Top 0.305: IC2.4 19.05,7.63 v19.05,7.3
  Bottom 0.305: C3.1 20.95,8.25 | 20.95,8.25 20.95,10.16 | 20.95,10.16 20.95,11.43 20.32,12.06 L2.1 | C5.+ 20.95,10.16 | v19.05,7.3 19.37,6.98 20.32,6.98 20.95,7.62 20.95,8.25
N$45  (via drill 0.3)
  Top 0.254: IC2.9 20.95,6 v20.95,4.45
  Bottom 0.305: 20.95,3.81 20.95,2.54 20.32,1.9 C7.1 | C8.+ 20.95,3.81 | L1.1 20.32,5.71 20.95,5.08 v20.95,4.45 20.95,3.81
N$46
  Top 0.254: Q2.3 16.49,7.6 16.51,7.62
  Top 0.305: IC2.3 18.34,7.62 16.51,7.62 12.06,7.62 11.64,7.2 C6.1
N$47
  Top 0.254: Q2.1 13.99,8.28 13.97,8.25
  Top 0.305: IC2.2 18.26,8.25 13.97,8.25 12.06,8.25 11.64,8.68 C4.1
NRST
  Top 0.305: IC2.22 29.35,5.08 29.84,5.08 31.11,6.35 35.56,6.35 36.2,6.98 36.2,11.43 37.47,12.7 IC1.3
NRST_EXT
  Top 0.305: IC1.14 46.99,12.7 46.35,12.06 46.35,6.35 46.99,5.71 51.44,5.71 52.7,6.98 54.61,6.98 X1.10
TCK
  Top 0.305: IC1.4 40.64,11.43 41.27,10.79 41.27,2.54 40.64,1.9 27.94,1.9 26.67,3.17 25.1,3.17 IC2.16
TCK_EXT
  Top 0.305: IC1.13 51.44,11.43 52.07,12.06 54.61,12.06 X1.4
TDI  (via drill 0.3)
  Top 0.305: IC2.17 28.35,2.54 37.47,2.54 38.1,3.17 v38.1,8.25
  Bottom 0.305: IC5.3 38.42,8.89 38.1,8.57 v38.1,8.25
TDI_EXT
  Bottom 0.305: IC5.14 51.44,8.89 52.07,9.53 54.61,9.53 X1.8
TDO
  Top 0.305: IC2.18 28.42,3.17 36.83,3.17 37.47,3.81 37.47,8.57 38.1,9.21 38.1,9.84 38.42,10.16 IC1.5
TDO_EXT
  Top 0.305: IC1.12 51.44,10.16 52.07,9.53 54.61,9.53 X1.6
TMS  (via drill 0.3)
  Top 0.305: IC2.19 28.5,3.81 36.2,3.81 36.83,4.45 36.83,9.21 v37.47,9.84
  Bottom 0.305: IC5.4 38.42,10.16 38.1,9.84 v37.47,9.84
TMS_EXT
  Bottom 0.305: IC5.13 51.44,10.16 52.07,10.79 52.07,13.97 52.7,14.61 54.61,14.61 X1.2
USBDM  (via drill 0.3)
  Top 0.254: v15.24,2.54 15.88,2.54 16.51,3.17 19.05,3.17 19.68,3.81 19.68,6.14 IC2.7
  Bottom 0.305: v15.24,2.54 13.97,3.81 13.97,10.79 13.06,11.7 L4.1
USBDP  (via drill 0.3)
  Top 0.254: v14.61,1.9 16.51,1.9 17.14,2.54 19.68,2.54 20.32,3.17 20.32,6.07 IC2.8
  Bottom 0.305: v14.61,1.9 13.34,3.17 13.34,10.16 12.79,10.7 L4.4
VCC_EXT  (via drill 0.3)
  Top 0.305: X1.1 52.07,15.88 51.44,15.24 v50.16,15.24 IC1.16 | IC1.10 v50.16,7.62 | LED2.A v54.61,19.69 | C20.2 v50.16,4.45
  Top 1.27: D4.C 52.7,17.14 53.34,16.51 X1.1
  Bottom 0.305: v54.61,19.69 53.98,19.69 53.34,19.05 X1.1 | v50.16,4.45 50.8,5.08 50.8,6.35 | 50.8,6.35 50.8,6.98 v50.16,7.62 | 50.8,6.35 IC5.16 46.99,6.35 46.35,6.98 46.35,13.34 46.99,13.97 IC5.10 49.53,13.97 50.16,14.61 v50.16,15.24

### Text on the board
Top: erprog / 1504-1
Bottom: erprog / 1504-1